# Altium schematic sheet BMS AFE - Cell Inputs.SchDoc: Title
size B; Organization: Midnight Sun Solar Rayce Car Team; Address1: University of Waterloo; Address2: 200 University Ave W; Address3: Waterloo, ON, Canada; Address4: N2L 3E9; DocumentNumber: 3; SheetNumber: 3; SheetTotal: 8; Website: www.uwmidsun.com; ProjectName: ProjectName
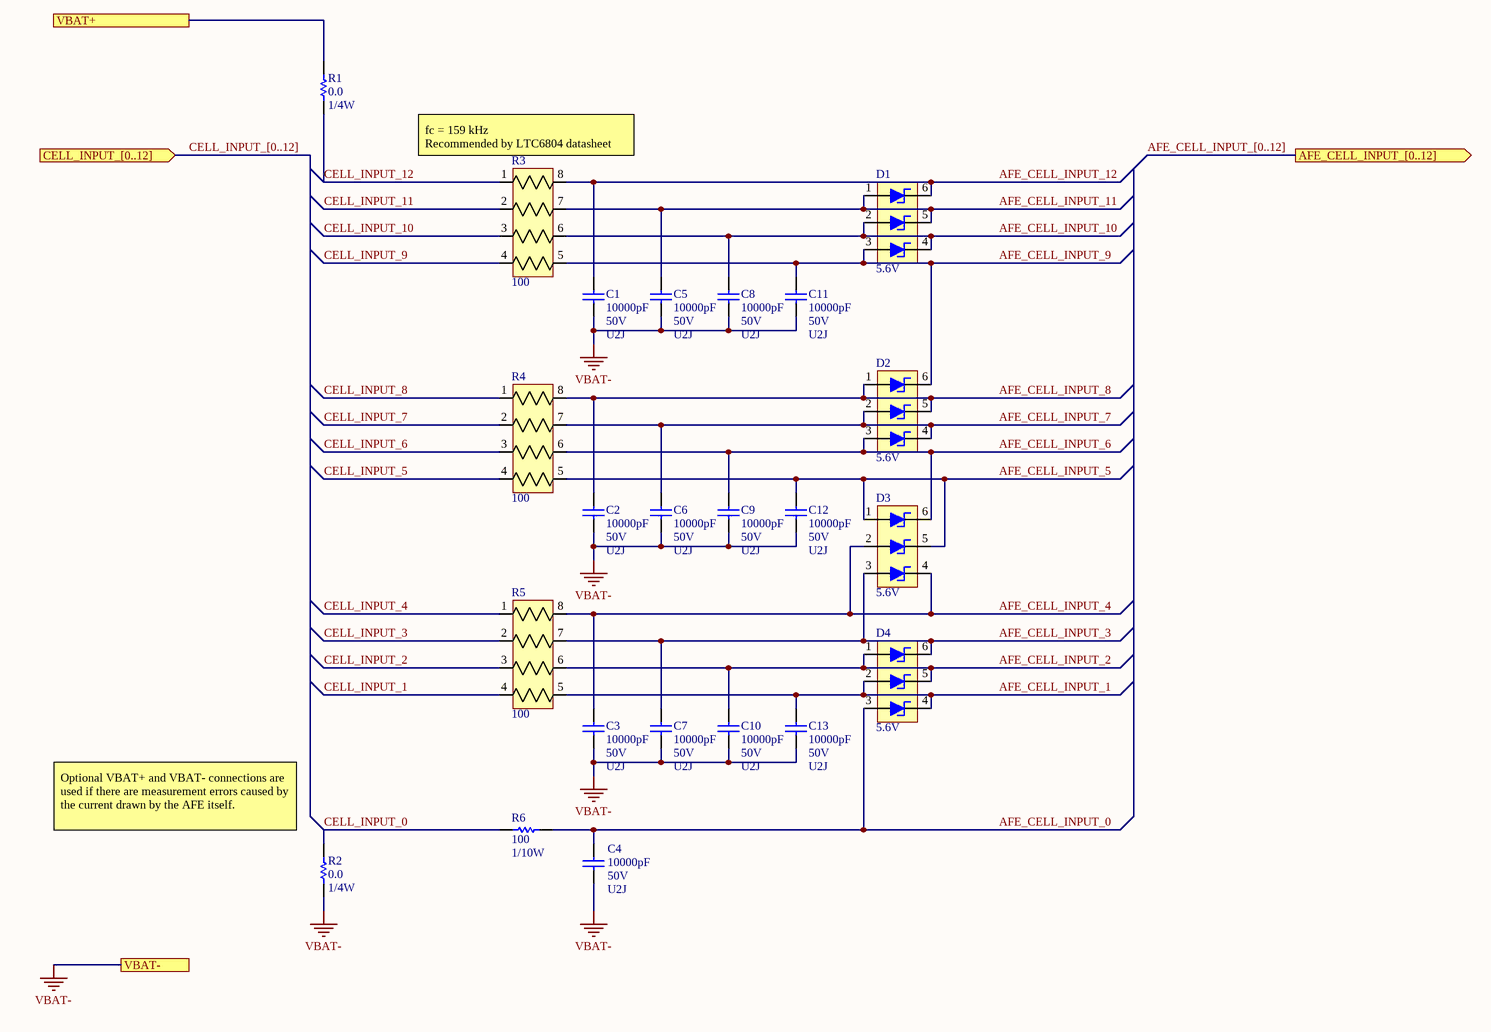
[diagram p0: BMS AFE - Cell Inputs.SchDoc]

## Parts
C1  Capacitance: 10000pF  Voltage: 50V  Temperature Coefficient: U2J  [CAP, 0603]  (hidden comment: CAP CER 10nF 50V 5% X7R 0603)
C2  Capacitance: 10000pF  Voltage: 50V  Temperature Coefficient: U2J  [CAP, 0603]  (hidden comment: CAP CER 10nF 50V 5% X7R 0603)
C3  Capacitance: 10000pF  Voltage: 50V  Temperature Coefficient: U2J  [CAP, 0603]  (hidden comment: CAP CER 10nF 50V 5% X7R 0603)
C4  Capacitance: 10000pF  Voltage: 50V  Temperature Coefficient: U2J  [CAP, 0603]  (hidden comment: CAP CER 10nF 50V 5% X7R 0603)
C5  Capacitance: 10000pF  Voltage: 50V  Temperature Coefficient: U2J  [CAP, 0603]  (hidden comment: CAP CER 10nF 50V 5% X7R 0603)
C6  Capacitance: 10000pF  Voltage: 50V  Temperature Coefficient: U2J  [CAP, 0603]  (hidden comment: CAP CER 10nF 50V 5% X7R 0603)
C7  Capacitance: 10000pF  Voltage: 50V  Temperature Coefficient: U2J  [CAP, 0603]  (hidden comment: CAP CER 10nF 50V 5% X7R 0603)
C8  Capacitance: 10000pF  Voltage: 50V  Temperature Coefficient: U2J  [CAP, 0603]  (hidden comment: CAP CER 10nF 50V 5% X7R 0603)
C9  Capacitance: 10000pF  Voltage: 50V  Temperature Coefficient: U2J  [CAP, 0603]  (hidden comment: CAP CER 10nF 50V 5% X7R 0603)
C10  Capacitance: 10000pF  Voltage: 50V  Temperature Coefficient: U2J  [CAP, 0603]  (hidden comment: CAP CER 10nF 50V 5% X7R 0603)
C11  Capacitance: 10000pF  Voltage: 50V  Temperature Coefficient: U2J  [CAP, 0603]  (hidden comment: CAP CER 10nF 50V 5% X7R 0603)
C12  Capacitance: 10000pF  Voltage: 50V  Temperature Coefficient: U2J  [CAP, 0603]  (hidden comment: CAP CER 10nF 50V 5% X7R 0603)
C13  Capacitance: 10000pF  Voltage: 50V  Temperature Coefficient: U2J  [CAP, 0603]  (hidden comment: CAP CER 10nF 50V 5% X7R 0603)
D1  5.6V  [SOT-363]
D2  5.6V  [SOT-363]
D3  5.6V  [SOT-363]
D4  5.6V  [SOT-363]
R1  Resistance: 0.0  Power (Watts): 1/4W  [RES, 0603]  (hidden comment: RES 0.0 OHM 1/4W 0603)
R2  Resistance: 0.0  Power (Watts): 1/4W  [RES, 0603]  (hidden comment: RES 0.0 OHM 1/4W 0603)
R3  Resistance: 100  [RES ARRAY 4RES 1206]  (hidden comment: RES ARRAY 100 OHM 0.5% 4RES 1206)
R4  Resistance: 100  [RES ARRAY 4RES 1206]  (hidden comment: RES ARRAY 100 OHM 0.5% 4RES 1206)
R5  Resistance: 100  [RES ARRAY 4RES 1206]  (hidden comment: RES ARRAY 100 OHM 0.5% 4RES 1206)
R6  Resistance: 100  Power: 1/10W  [RES, 0603]  (hidden comment: RES 100 OHM 1% 1/10W 0603)

## Ports
AFE_CELL_INPUT_[0..12] (out), CELL_INPUT_[0..12] (in), VBAT+, VBAT-

## Nets
VBAT-: C1.2 C2.2 C3.2 C4.2 C5.2 C6.2 C7.2 C8.2 C9.2 C10.2 C11.2 C12.2 C13.2 R2.2 ; port VBAT-
AFE_CELL_INPUT_0: C4.1 D4.3(A3) R6.2
AFE_CELL_INPUT_1: C13.1 D4.2(A2) D4.4(C3) R5.5
AFE_CELL_INPUT_2: C10.1 D4.1(A1) D4.5(C2) R5.6
AFE_CELL_INPUT_3: C7.1 D3.3(A3) D4.6(C1) R5.7
AFE_CELL_INPUT_4: C3.1 D3.2(A2) D3.4(C3) R5.8
AFE_CELL_INPUT_5: C12.1 D3.1(A1) D3.5(C2) R4.5
AFE_CELL_INPUT_6: C9.1 D2.3(A3) D3.6(C1) R4.6
AFE_CELL_INPUT_7: C6.1 D2.2(A2) D2.4(C3) R4.7
AFE_CELL_INPUT_8: C2.1 D2.1(A1) D2.5(C2) R4.8
AFE_CELL_INPUT_9: C11.1 D1.3(A3) D2.6(C1) R3.5
AFE_CELL_INPUT_10: C8.1 D1.2(A2) D1.4(C3) R3.6
AFE_CELL_INPUT_11: C5.1 D1.1(A1) D1.5(C2) R3.7
AFE_CELL_INPUT_12: C1.1 D1.6(C1) R3.8
CELL_INPUT_0: R2.1 R6.1
CELL_INPUT_1: R5.4
CELL_INPUT_2: R5.3
CELL_INPUT_3: R5.2
CELL_INPUT_4: R5.1
CELL_INPUT_5: R4.4
CELL_INPUT_6: R4.3
CELL_INPUT_7: R4.2
CELL_INPUT_8: R4.1
CELL_INPUT_9: R3.4
CELL_INPUT_10: R3.3
CELL_INPUT_11: R3.2
CELL_INPUT_12: R1.2 R3.1
VBAT+: R1.1 ; port VBAT+

## Buses and harness runs
bus AFE_CELL_INPUT_[0..12] = port AFE_CELL_INPUT_[0..12]
bus CELL_INPUT_[0..12] = port CELL_INPUT_[0..12]

## Notes on the sheet
- (near R3) fc = 159 kHz
  Recommended by LTC6804 datasheet
- (near R2) Optional VBAT+ and VBAT- connections are used if there are measurement errors caused by the current drawn by the AFE itself.
- PROJECT
- DOCUMENT
- DRAWN BY
- LAST MODIFIED
- PART NUMBER
- REVISION
- SHEET
- VARIANT
- OF
- Engineering 5 - 1002
  University of Waterloo
  (519) 888-4567 x32978
  hardware@uwmidsun.com

## Library data of the parts
C1-C13 = CAP CER 10nF 50V 5% X7R 0603: 10000pF ±5% 50V Ceramic Capacitor U2J 0603 (1608 Metric); Manufacturer 1: KEMET; Manufacturer Part Number 1: C0603C103J5JAC7867; Supplier 1: Digi-Key; Supplier Part Number 1: 399-13384-1-ND; Packaging: Cut Tape (CT); Part Status: Active; Operating Temperature: -55°C ~ 125°C; Ratings: -; Failure Rate: -; Mounting Type: Surface Mount, MLCC; Package / Case: 0603 (1608 Metric); Size / Dimension: 0.063" L x 0.032" W (1.60mm x 0.80mm); Height - Seated (Max): -; Thickness (Max): 0.034" (0.87mm); Lead Spacing: -; Lead Style: -; ComponentLink1URL: http://www.kemet.com/docfinder?Partnumber=C0603C103J5JAC7867; ComponentLink1Description: http://www.kemet.com/docfinder?Partnumber=C0603C103J5JAC7867; Tolerance: ±5%
D1-D4 = DIODE ZENER ARRAY 5.6V SOT363: Zener Diode Array 3 Independent 5.6V 200mW ±6% SOT-363; Manufacturer: Diodes; Manufacturer Part Number: BZX84C5V6TS-7-F; Voltage Tolerance: 7.14%; Impedance: 40R; Peak Reverse Current: 1uA; Test Current: 5mA; Forward Voltage: 900mV; ESD Protection: No; Mount: Surface Mount; Case/Package: SOT-363; Number of Pins: 6; Weight: 0.000212oz; Contact Plating: Tin,Matte; Min Operating Temperature: -65°C; Max Operating Temperature: 150°C; Max Power Dissipation: 200mW; Zener Voltage: 5.6V; Packaging: Tape and Reel; Package Quantity: 3000; Max Reverse Leakage Current: 1uA; Power Dissipation: 200mW; Tolerance: 6%; Zener Current: 1uA; Power Rating: 200mW; Voltage Rating (DC): 5.6V; Length: 2.2mm; Height: 1mm; Width: 2.2mm; Lead Free: Lead Free; ComponentLink1URL: https://datasheet.ciiva.com/10642/ds30187-10642567.pdf?src-supplier=Avnet; ComponentLink1Description: https://datasheet.ciiva.com/10642/ds30187-10642567.pdf?src-supplier=Avnet; ComponentLink2URL: https://datasheet.ciiva.com/17267/ds30187-17267470.pdf?src-supplier=Avnet+Europe; ComponentLink2Description: https://datasheet.ciiva.com/17267/ds30187-17267470.pdf?src-supplier=Avnet+Europe; Supplier 1: Digi-Key; Supplier Part Number 1: BZX84C5V6TS-FDICT-ND; Pricing 1: 1=0.42000, 10=0.31700, 100=0.15080, 500=0.13364, 1000=0.10400 (USD); RoHS: Yes; Stock 1: 3211
R1 R2 = RES 0.0 OHM 1/4W 0603: RES SMD 0.0 OHM JUMPER 1/4W 0603; Manufacturer 1: Vishay Dale; Manufacturer Part Number 1: CRCW06030000Z0EAHP; Supplier 1: Digi-Key; Supplier Part Number 1: 541-0.0SBCT-ND; Packaging: Cut Tape (CT); Part Status: Active; Composition: Thick Film; Operating Temperature: -55°C ~ 155°C; Package / Case: 0603 (1608 Metric); Supplier Device Package: 0603; Size / Dimension: 0.063" L x 0.033" W (1.60mm x 0.85mm); Height - Seated (Max): 0.022" (0.55mm); Failure Rate: -; ComponentLink1URL: http://www.vishay.com/docs/20043/crcwhpe3.pdf; ComponentLink1Description: http://www.vishay.com/docs/20043/crcwhpe3.pdf
R3-R5 = RES ARRAY 100 OHM 0.5% 4RES 1206: 100 Ohm ±0.5% 100mW Power Per Element Isolated 4 Resistor Network/Array ±50ppm/°C 1206 (3216 Metric), Convex, Long Side Terminals; Manufacturer: Vishay Beyschlag; Manufacturer Part Number: ACASA1002S1002P100; Number of Resistors: 4; Power Rating: 300mW; RoHS: RoHS Compliant; Category: Resistors; Packaging: Cut Tape (CT); Part Status: Active; Circuit Type: Isolated; Power Per Element: 100mW; Temperature Coefficient: ±50ppm/°C; Operating Temperature: -55°C ~ 125°C; Applications: Voltage Divider (TCR Matched); Mounting Type: Surface Mount; Package / Case: 1206 (3216 Metric), Convex, Long Side Terminals; Supplier Device Package: 0612; Size / Dimension: 0.126" L x 0.059" W (3.20mm x 1.50mm); Height - Seated (Max): 0.022" (0.55mm); Mount: Surface Mount; Case/Package: 0612; Number of Pins: 8; Weight: 0.000233oz; Number of Terminals: 8; Case Code (Metric): 3216; Case Code (Imperial): 1206; Min Operating Temperature: -55°C; Max Operating Temperature: 125°C; Package Quantity: 1; Termination: Convex; Military Standard: Not; Length: 1.5mm; Height: 0.55mm; Width: 3.2mm; Depth: 1.5mm; Terminal Pitch: 0.8mm; Radiation Hardening: No; ComponentLink3URL: https://datasheet.ciiva.com/8336/acaprof-8336568.pdf?src-supplier=Avnet; ComponentLink3Description: https://datasheet.ciiva.com/8336/acaprof-8336568.pdf?src-supplier=Avnet; Tolerance: ±0.5%; Pricing 1: 1=0.74000, 10=0.54700, 25=0.44400, 50=0.38620, 100=0.31850, 250=0.27672, 500=0.22522 (USD); Stock 1: 5815; Supplier 1: Digi-Key; Supplier Part Number 1: ACASA-100/100-2CT-ND
R6 = RES 100 OHM 1% 1/10W 0603: 100 Ohm ±1% 0.1W, 1/10W Chip Resistor 0603 (1608 Metric) Moisture Resistant Thick Film; Manufacturer 1: Yageo; Manufacturer Part Number 1: RC0603FR-07100RL; Temperature Coefficient: ±100ppm/°C; Supplier 1: Digi-Key; Supplier Part Number 1: 311-100HRCT-ND; Packaging: Cut Tape (CT); Part Status: Active; Composition: Thick Film; Operating Temperature: -55°C ~ 155°C; Package / Case: 0603 (1608 Metric); Supplier Device Package: 0603; Size / Dimension: 0.063" L x 0.031" W (1.60mm x 0.80mm); Height - Seated (Max): 0.022" (0.55mm); Failure Rate: -; ComponentLink1URL: http://www.yageo.com/documents/recent/PYu-RC_Group_51_RoHS_L_7.pdf; ComponentLink1Description: http://www.yageo.com/documents/recent/PYu-RC_Group_51_RoHS_L_7.pdf; Tolerance: ±1%